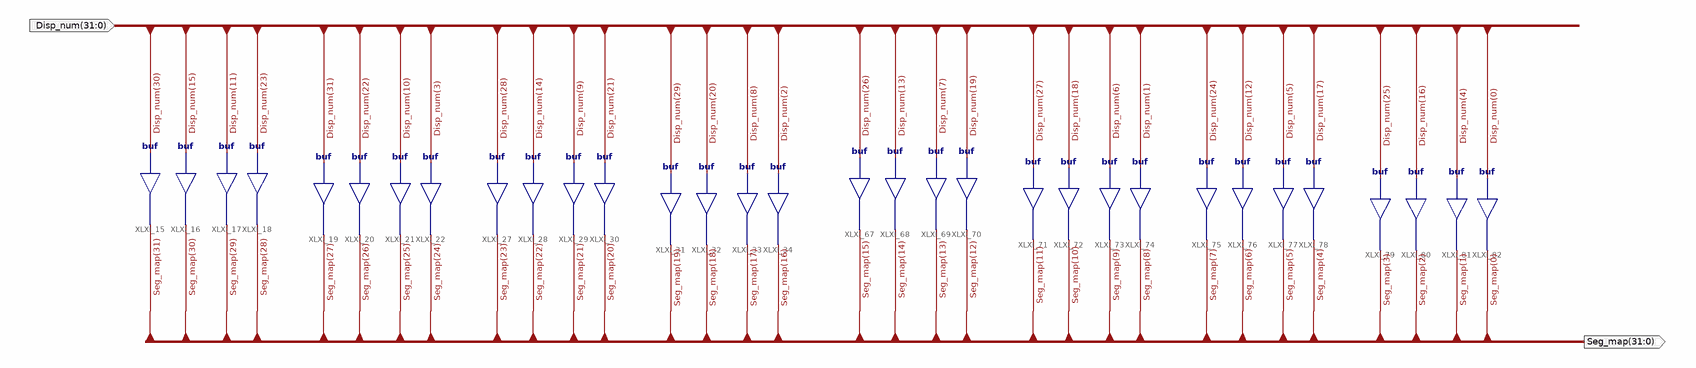
[diagram p0: schematic sheet 1]
// Xilinx ISE schematic half_SSeg_map.sch (kintex7) as structural Verilog: 32 symbols, 2 ports
module half_SSeg_map (
  input  [31:0] Disp_num,
  output [31:0] Seg_map
);

  buf XLXI_15 (Seg_map[31], Disp_num[30]);
  buf XLXI_16 (Seg_map[30], Disp_num[15]);
  buf XLXI_17 (Seg_map[29], Disp_num[11]);
  buf XLXI_18 (Seg_map[28], Disp_num[23]);
  buf XLXI_19 (Seg_map[27], Disp_num[31]);
  buf XLXI_20 (Seg_map[26], Disp_num[22]);
  buf XLXI_21 (Seg_map[25], Disp_num[10]);
  buf XLXI_22 (Seg_map[24], Disp_num[3]);
  buf XLXI_27 (Seg_map[23], Disp_num[28]);
  buf XLXI_28 (Seg_map[22], Disp_num[14]);
  buf XLXI_29 (Seg_map[21], Disp_num[9]);
  buf XLXI_30 (Seg_map[20], Disp_num[21]);
  buf XLXI_31 (Seg_map[19], Disp_num[29]);
  buf XLXI_32 (Seg_map[18], Disp_num[20]);
  buf XLXI_33 (Seg_map[17], Disp_num[8]);
  buf XLXI_34 (Seg_map[16], Disp_num[2]);
  buf XLXI_67 (Seg_map[15], Disp_num[26]);
  buf XLXI_68 (Seg_map[14], Disp_num[13]);
  buf XLXI_69 (Seg_map[13], Disp_num[7]);
  buf XLXI_70 (Seg_map[12], Disp_num[19]);
  buf XLXI_71 (Seg_map[11], Disp_num[27]);
  buf XLXI_72 (Seg_map[10], Disp_num[18]);
  buf XLXI_73 (Seg_map[9], Disp_num[6]);
  buf XLXI_74 (Seg_map[8], Disp_num[1]);
  buf XLXI_75 (Seg_map[7], Disp_num[24]);
  buf XLXI_76 (Seg_map[6], Disp_num[12]);
  buf XLXI_77 (Seg_map[5], Disp_num[5]);
  buf XLXI_78 (Seg_map[4], Disp_num[17]);
  buf XLXI_79 (Seg_map[3], Disp_num[25]);
  buf XLXI_80 (Seg_map[2], Disp_num[16]);
  buf XLXI_81 (Seg_map[1], Disp_num[4]);
  buf XLXI_82 (Seg_map[0], Disp_num[0]);
endmodule
